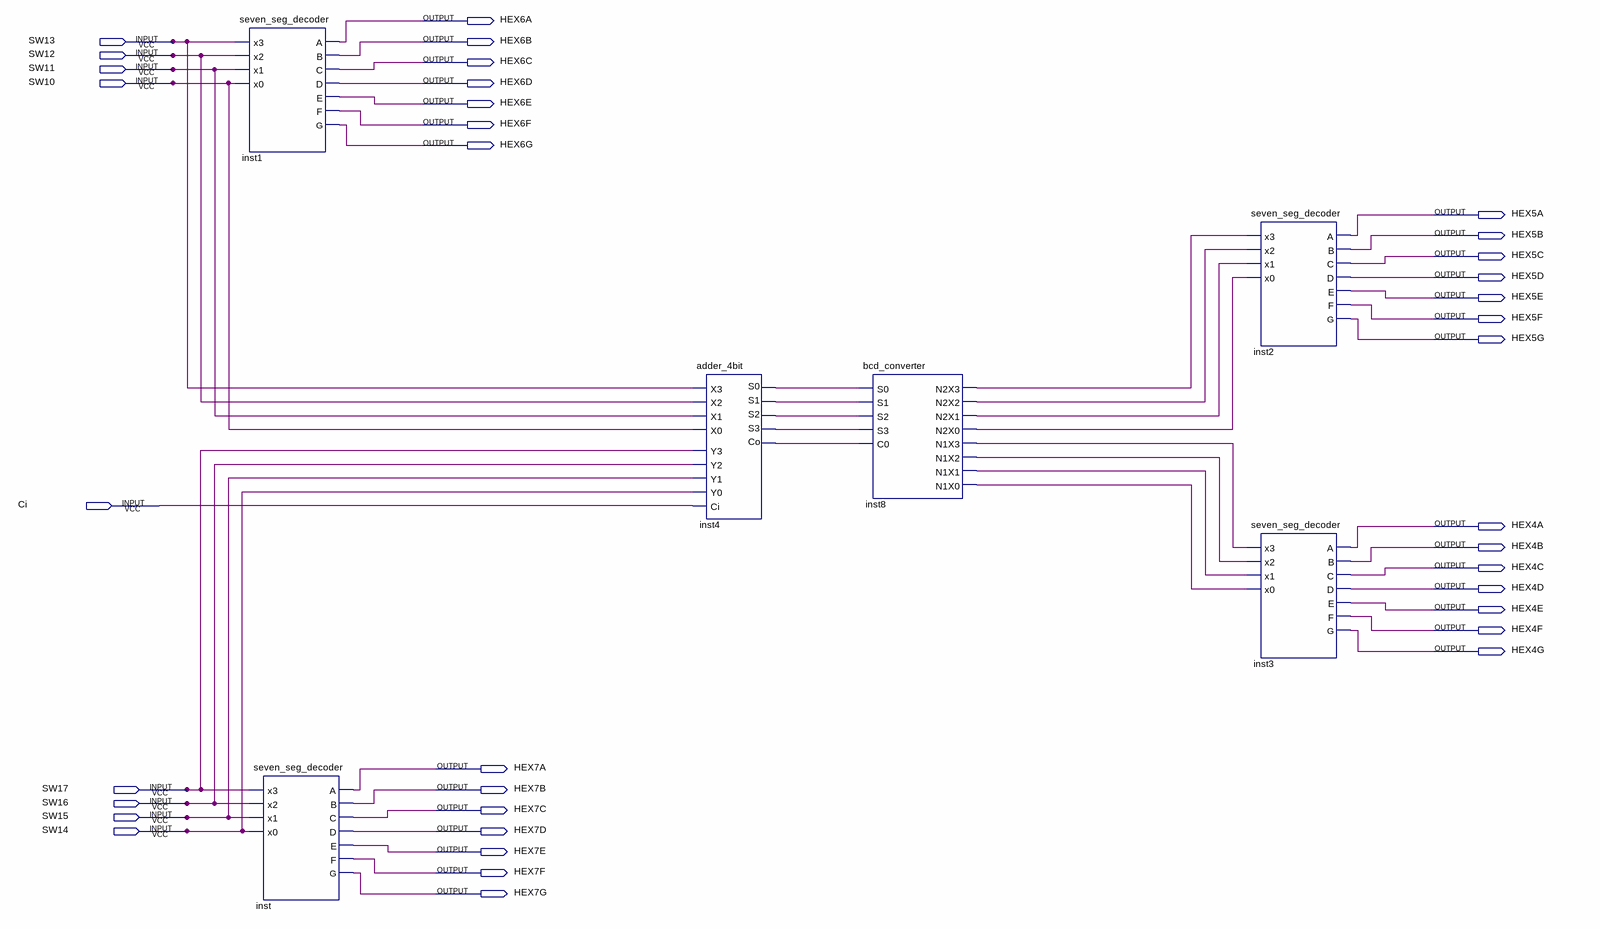
[diagram p0: schematic sheet]
// Quartus schematic lab6.bdf as structural Verilog: 6 symbols, 37 pins
module lab6 (
  input  SW13,
  input  SW12,
  input  SW11,
  input  SW10,
  input  Ci,
  input  SW17,
  input  SW16,
  input  SW15,
  input  SW14,
  output HEX6A,
  output HEX6B,
  output HEX6C,
  output HEX6D,
  output HEX6E,
  output HEX6F,
  output HEX6G,
  output HEX5A,
  output HEX5B,
  output HEX5C,
  output HEX5D,
  output HEX5E,
  output HEX5F,
  output HEX5G,
  output HEX4A,
  output HEX4B,
  output HEX4C,
  output HEX4D,
  output HEX4E,
  output HEX4F,
  output HEX4G,
  output HEX7A,
  output HEX7B,
  output HEX7C,
  output HEX7D,
  output HEX7E,
  output HEX7F,
  output HEX7G
);

  wire inst4_co, inst4_s0, inst4_s1, inst4_s2, inst4_s3, inst8_n1x0, inst8_n1x1, inst8_n1x2, inst8_n1x3,
       inst8_n2x0, inst8_n2x1, inst8_n2x2, inst8_n2x3;

  seven_seg_decoder inst1 (
    .x3(SW13), .x2(SW12), .x1(SW11), .x0(SW10), .A(HEX6A), .B(HEX6B), .C(HEX6C), .D(HEX6D), .E(HEX6E),
    .F(HEX6F), .G(HEX6G));
  seven_seg_decoder inst (
    .x3(SW17), .x2(SW16), .x1(SW15), .x0(SW14), .A(HEX7A), .B(HEX7B), .C(HEX7C), .D(HEX7D), .E(HEX7E),
    .F(HEX7F), .G(HEX7G));
  adder_4bit inst4 (
    .X3(SW13), .Y3(SW17), .X2(SW12), .Y2(SW16), .X1(SW11), .Y1(SW15), .X0(SW10), .Y0(SW14), .Ci(Ci),
    .S0(inst4_s0), .S1(inst4_s1), .S2(inst4_s2), .S3(inst4_s3), .Co(inst4_co));
  bcd_converter inst8 (
    .S0(inst4_s0), .S1(inst4_s1), .S2(inst4_s2), .S3(inst4_s3), .C0(inst4_co), .N2X3(inst8_n2x3),
    .N2X2(inst8_n2x2), .N2X1(inst8_n2x1), .N2X0(inst8_n2x0), .N1X3(inst8_n1x3), .N1X2(inst8_n1x2),
    .N1X1(inst8_n1x1), .N1X0(inst8_n1x0));
  seven_seg_decoder inst2 (
    .x3(inst8_n2x3), .x2(inst8_n2x2), .x1(inst8_n2x1), .x0(inst8_n2x0), .A(HEX5A), .B(HEX5B), .C(HEX5C),
    .D(HEX5D), .E(HEX5E), .F(HEX5F), .G(HEX5G));
  seven_seg_decoder inst3 (
    .x3(inst8_n1x3), .x2(inst8_n1x2), .x1(inst8_n1x1), .x0(inst8_n1x0), .A(HEX4A), .B(HEX4B), .C(HEX4C),
    .D(HEX4D), .E(HEX4E), .F(HEX4F), .G(HEX4G));
endmodule
